# EAGLE design amiga2gameport_alternate (EAGLE 4.16)
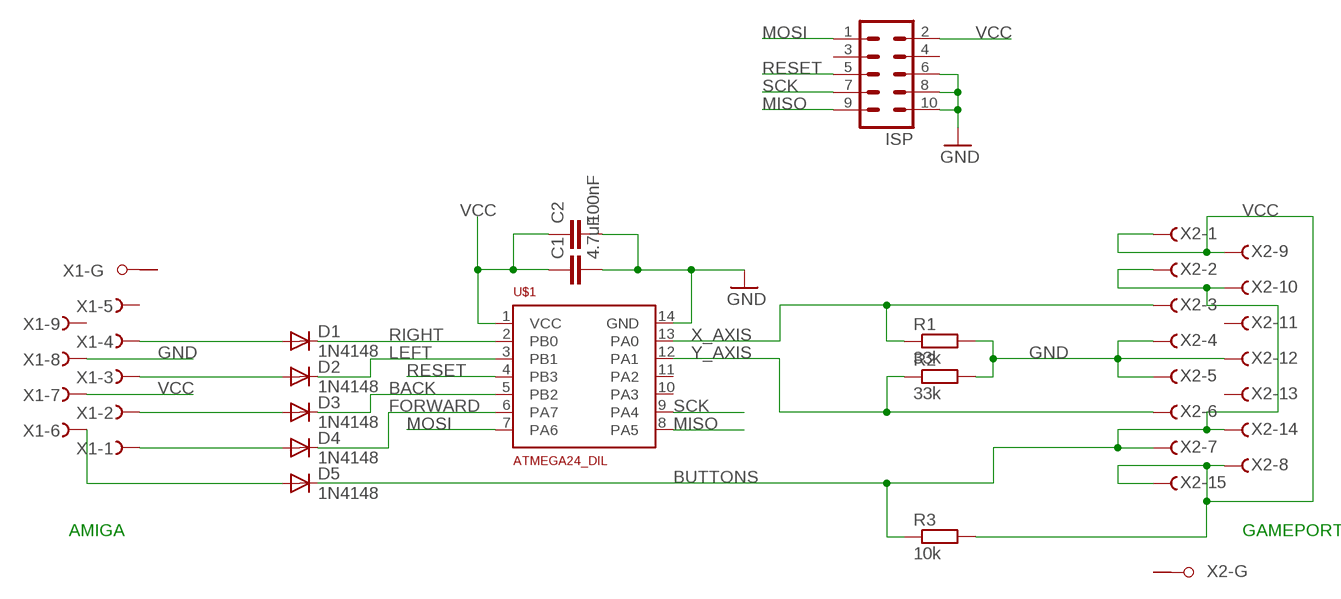
[diagram p0: schematic, sheet 1]

## Parts
C1  4.7uF  C-EU050-024X044  [C050-024X044]
C2  100nF  C-EU050-024X044  [C050-024X044]
D1  1N4148  [DO35-10]
D2  1N4148  [DO35-10]
D3  1N4148  [DO35-10]
D4  1N4148  [DO35-10]
D5  1N4148  [DO35-10]
ISP  MA05-2  [MA05-2]
R1  33k  R-EU_0309/10  [0309/10]
R2  33k  R-EU_0309/10  [0309/10]
R3  10k  R-EU_0309/10  [0309/10]
U$1  ATMEGA24_DIL  [DIL14]
X1  F09HPS  [F09HP]
X2  F15HPS  [F15HP]

## Nets
BACK: D3.C U$1.5(PB2)
BUTTONS: D5.C R3.1 X2.2(-2:F) X2.7(-7:F) X2.10(-10:F) X2.14(-14:F)
FORWARD: D4.C U$1.6(PA7)
GND: C1.2 C2.2 ISP.6 ISP.8 ISP.10 R1.2 R2.2 U$1.14(GND) X1.8(-8:F) X2.4(-4:F) X2.5(-5:F) X2.12(-12:F)
LEFT: D2.C U$1.3(PB1)
MISO: ISP.9 U$1.8(PA5)
MOSI: ISP.1 U$1.7(PA6)
N$1: D1.A X1.4(-4:F)
N$4: D3.A X1.2(-2:F)
N$7: D2.A X1.3(-3:F)
N$8: D4.A X1.1(-1:F)
N$10: D5.A X1.6(-6:F)
RESET: ISP.5 U$1.4(PB3)
RIGHT: D1.C U$1.2(PB0)
SCK: ISP.7 U$1.9(PA4)
VCC: C1.1 C2.1 ISP.2 R3.2 U$1.1(VCC) X1.7(-7:F) X2.1(-1:F) X2.8(-8:F) X2.9(-9:F) X2.15(-15:F)
X_AXIS: R1.1 U$1.13(PA0) X2.3(-3:F)
Y_AXIS: R2.1 U$1.12(PA1) X2.6(-6:F)
Unconnected: ISP.3 ISP.4 U$1.10(PA3) U$1.11(PA2) X1.5(-5:F) X1.9(-9:F) X1.G1(-G:G1) X1.G2(-G:G2) X2.11(-11:F) X2.13(-13:F) X2.G1(-G:G1) X2.G2(-G:G2)

## Notes on the sheet
- AMIGA | GAMEPORT

## Library data of the parts
C1 C2 = rcl:C-EU: CAPACITOR, European symbol
D1-D5 = diode:1N4148: DIODE high speed (Philips)
ISP = con-lstb:MA05-2: PIN HEADER
R1-R3 = rcl:R-EU_: RESISTOR, European symbol
U$1 = atmel:ATMEGA24_DIL
X1 = con-subd:F09HPS: SUB-D
X2 = con-subd:F15HPS: SUB-D

## Board
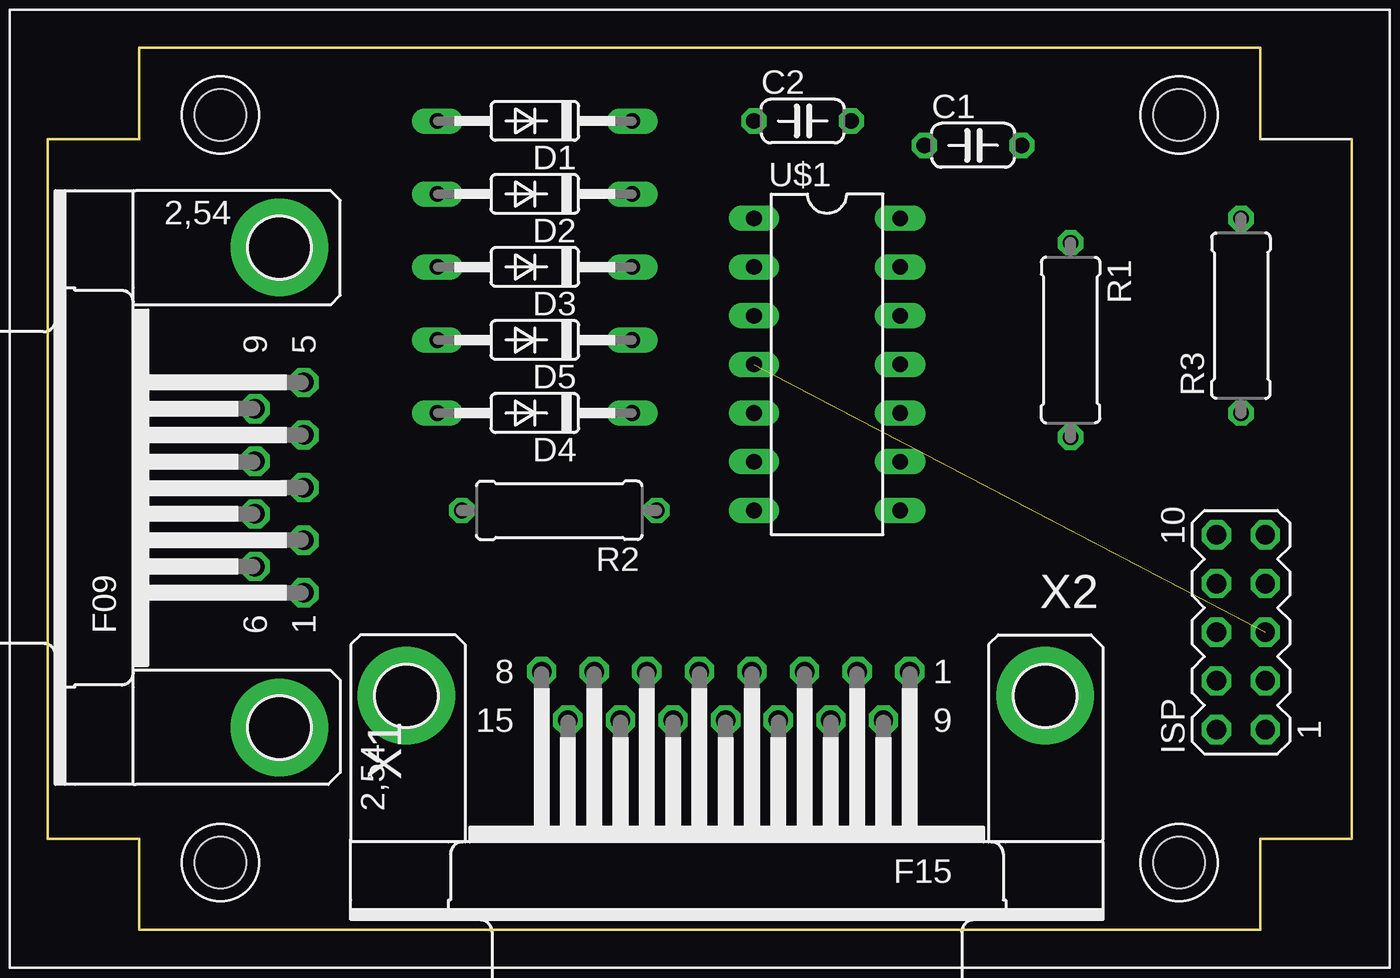
[diagram p1: board, top side]
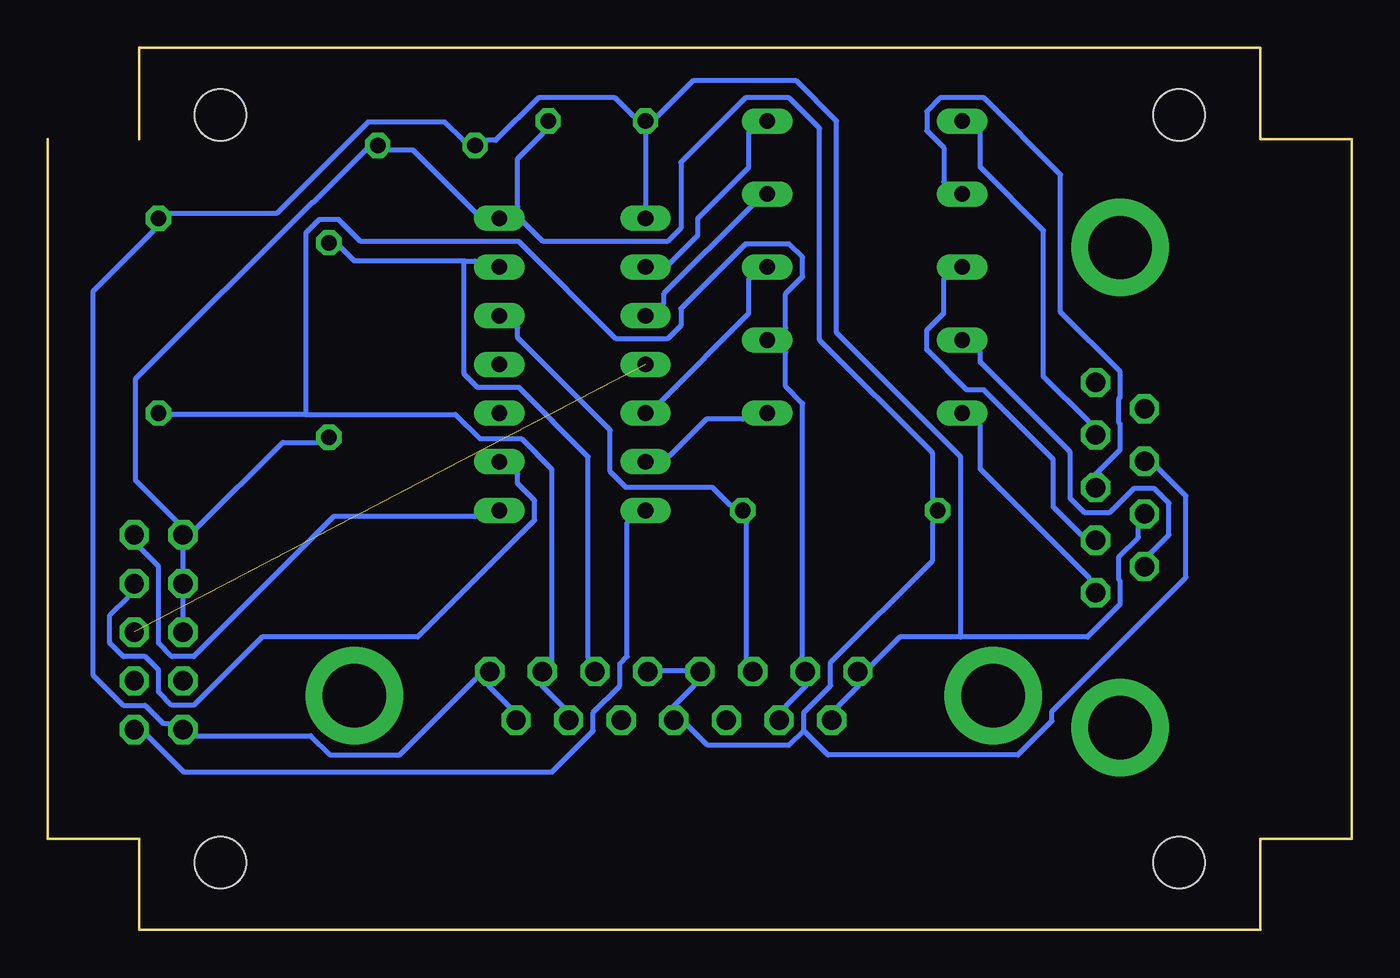
[diagram p2: board, bottom side, seen from below]

Size 68 x 46 mm. Coordinates in mm from the lower left corner, seen from the top.
Copper layers (1*16): Top 0.035mm / dielectric 1.5mm / Bottom 0.035mm
Design rules "default": minimum track width 10mil, minimum drill 24mil, track to track 25mil, track to pad 15mil, pad to pad 15mil, via to via 10mil, smd to smd 8mil, copper to edge 40mil, drill to drill 8mil, minimum pad ring 10mil, minimum via ring 8mil, stop-mask expansion 4mil, vias tented up to drill 0mil, thermal gap 10mil

### Footprints (pad centres in the part's own frame; a part is rotated, then mirrored left to right if it is on the bottom)
C050-024X044 = drill 0.813 octagon: 1 -2.54,0; 2 2.54,0
DO35-10 = drill 0.813 long: A 5.08,0; C -5.08,0
MA05-2 = drill 1.016 octagon: 1 -5.08,-1.27; 2 -5.08,1.27; 3 -2.54,-1.27; 4 -2.54,1.27; 5 0,-1.27; 6 0,1.27; 7 2.54,-1.27; 8 2.54,1.27; 9 5.08,-1.27; 10 5.08,1.27
0309/10 = drill 0.813 octagon: 1 -5.08,0; 2 5.08,0
DIL14 = drill 0.813 long: 1 -7.62,-3.81; 2 -5.08,-3.81; 3 -2.54,-3.81; 4 0,-3.81; 5 2.54,-3.81; 6 5.08,-3.81; 7 7.62,-3.81; 8 7.62,3.81; 9 5.08,3.81; 10 2.54,3.81; 11 0,3.81; 12 -2.54,3.81; 13 -5.08,3.81; 14 -7.62,3.81
G028 = hole 2.7: 9,-3.5; 59,-3.5; 9,-42.5; 59,-42.5
F09HP = drill 1.016 octagon: 1 -5.486,-1.27; 2 -2.743,-1.27; 3 0,-1.27; 4 2.743,-1.27; 5 5.486,-1.27; 6 -4.115,1.27; 7 -1.372,1.27; 8 1.372,1.27; 9 4.115,1.27 | drill 3.302 pad 5.08 round: G1 -12.522,0; G2 12.522,0
F15HP = drill 1.016 octagon: 1 -9.601,-1.27; 2 -6.858,-1.27; 3 -4.115,-1.27; 4 -1.372,-1.27; 5 1.372,-1.27; 6 4.115,-1.27; 7 6.858,-1.27; 8 9.601,-1.27; 9 -8.23,1.27; 10 -5.486,1.27; 11 -2.743,1.27; 12 0,1.27; 13 2.743,1.27; 14 5.486,1.27; 15 8.23,1.27 | drill 3.302 pad 5.08 round: G1 -16.662,0; G2 16.662,0

### Placement (x,y rotation side)
C1  48.26,40.92 0 top
C2  39.37,42.19 0 top
D1  25.4,42.19 180 top
D2  25.4,38.38 180 top
D3  25.4,34.57 180 top
D4  25.4,26.95 180 top
D5  25.4,30.76 180 top
ISP  62.23,15.52 90 top
R1  53.34,30.76 270 top
R2  26.67,21.87 180 top
R3  62.23,32.03 90 top
U$1  40.64,29.49 270 top
U$2  [G028]  0,46 0 top
X1  12.08,23.06 90 top
X2  35.35,12.2 180 top

### Tracks (layer width: path | path; a pad name or v marks a point on that pad's centre or on a via)
BACK
  Bottom 0.254: D3.C 31.43,33.94 31.43,32.16 36,27.59 U$1.5
BUTTONS
  Bottom 0.254: X2.14 29.53,11.65 28.45,12.73 X2.7 28.64,14.19 28.64,27.46 29.53,28.35 29.53,30.12 D5.C 29.53,31.39 29.53,33.17 28.64,34.06 28.64,35.08 29.34,35.78 31.62,35.78 34.99,32.41 34.99,31.52 35.69,30.82 38.35,30.82 43.43,35.9 51.69,35.9 52.83,37.05 53.85,37.05 54.55,36.35 54.55,26.89 | 54.55,26.89 46.74,26.89 45.47,25.62 43.31,25.62 41.72,24.03 41.72,14 X2.2 42.23,12.73 41.15,11.65 X2.10 | 54.55,26.89 61.59,26.89 R3.1
FORWARD
  Bottom 0.254: D4.C 31.75,26.63 33.65,26.63 35.56,24.73 U$1.6
GND
  Bottom 0.254: X2.4 36,13.49 34.73,13.49 X2.5 34.29,12.73 35.37,11.65 X2.12 34.61,10.63 33.59,9.61 29.34,9.61 28.57,10.38 | 28.57,10.38 28.57,11.33 27.18,12.73 27.18,13.93 21.84,19.27 21.84,21.23 R2.2 21.84,22.51 21.84,24.85 27.75,30.76 27.75,41.81 29.34,43.4 31.62,43.4 34.99,40.03 34.99,36.6 35.69,35.9 42.16,35.9 43.18,36.92 U$1.14 | X1.8 10.1,24.09 8.64,22.63 8.64,18.38 15.62,11.39 15.62,10.88 17.4,9.11 27.3,9.11 28.57,10.38 | U$1.14 43.5,37.74 43.5,40.22 42.16,41.55 C2.2 | U$1.14 45.72,37.43 48.96,40.67 50.16,40.67 C1.2 51.43,40.67 54.16,37.94 54.23,37.94 63.44,28.73 63.44,23.46 61.28,21.3 ISP.10 | ISP.6 ISP.8 ISP.10 | R1.2 53.97,25.43 55.75,25.43 60.26,20.92 ISP.10
LEFT
  Bottom 0.254: U$1.3 35.88,32.66 35.88,33.17 31.31,37.74 D2.C
MISO
  Bottom 0.254: U$1.8 45.72,21.55 53.09,21.55 60.39,14.25 61.53,14.25 62.23,14.95 62.23,18.95 63.18,19.9 ISP.9
MOSI
  Bottom 0.254: U$1.7 37.78,21.23 37.78,14.25 38.16,13.87 38.16,12.73 39.56,11.33 39.56,10.38 41.72,8.22 60.9,8.22 62.8,10.12 ISP.1
N$1
  Bottom 0.254: D1.A 19.37,41.55 19.37,39.78 16.07,36.48 16.07,28.85 13.72,26.51 X1.4
N$4
  Bottom 0.254: D3.A 21.27,33.94 21.27,32.16 22.16,31.27 22.16,30.25 20.07,28.16 19.18,28.16 15.56,24.54 15.56,22.06 14.1,20.6 X1.2
N$7
  Bottom 0.254: D2.A 21.27,39.02 21.27,40.79 22.16,41.68 22.16,42.7 21.46,43.4 19.18,43.4 15.18,39.4 15.18,32.22 12.07,29.11 12.07,27.78 12.13,27.71 12.13,26.44 12.07,26.38 12.07,25.05 13.34,23.77 X1.3
N$8
  Bottom 0.254: D4.A 19.37,26.31 19.37,24.03 13.65,18.31 X1.1
N$10
  Bottom 0.254: D5.A 19.37,30.12 19.37,29.62 14.67,24.92 14.67,22.51 13.91,21.74 12.64,21.74 11.37,23.01 10.29,23.01 9.53,22.25 9.53,20.6 10.48,19.65 X1.6
RESET  (1 unrouted)
RIGHT
  Bottom 0.254: D1.C 31.43,41.55 31.43,39.78 34.1,37.11 34.1,36.22 35.56,34.76 U$1.2
SCK
  Bottom 0.254: U$1.9 43.5,23.77 43.5,23.27 42.61,22.38 42.61,21.36 48.7,15.27 56.83,15.27 60.39,11.71 61.53,11.71 62.23,12.41 62.23,13.55 62.93,14.25 64.07,14.25 64.77,14.95 64.77,16.41 63.82,17.36 ISP.7
VCC
  Bottom 0.254: X2.15 26.8,11.65 25.72,12.73 X2.8 25.02,13.8 23.56,15.27 20.38,15.27 | 20.38,15.27 13.78,15.27 12.07,16.98 12.07,18.19 12.13,18.25 12.13,19.46 11.11,20.47 11.11,20.98 X1.7 | X2.9 43.94,11.65 45.02,12.73 X2.1 45.66,13.11 49.66,9.11 53.28,9.11 54.29,10.12 60.26,10.12 ISP.2 61.66,10.76 61.98,10.76 62.93,11.71 64.07,11.71 65.66,13.3 65.66,33.3 62.48,36.48 R3.2 61.59,37.36 56.07,37.36 51.31,42.13 47.31,42.13 46.35,41.17 C1.1 45.08,41.17 44.64,41.17 42.42,43.4 38.42,43.4 37.46,42.44 C2.1 | C2.1 U$1.1 | 20.38,15.27 20.38,24.66 26.86,31.14 26.86,42.19 28.96,44.28 34.35,44.28 36.2,42.44 C2.1
X_AXIS
  Bottom 0.254: 46.29,34.89 52.01,34.89 52.7,35.59 R1.1 | 46.29,34.89 45.72,34.89 U$1.13 | X2.3 39.81,14.19 39.81,24.66 43.43,28.28 45.59,28.28 46.29,28.98 46.29,34.89
Y_AXIS
  Bottom 0.254: X2.6 31.56,14.19 31.56,21.23 R2.1 32.38,22.12 33.34,23.08 37.85,23.08 38.67,23.9 38.67,26.06 43.5,30.89 43.5,31.39 U$1.12